# EAGLE design hover_controller_v3 (EAGLE 8.2.1)
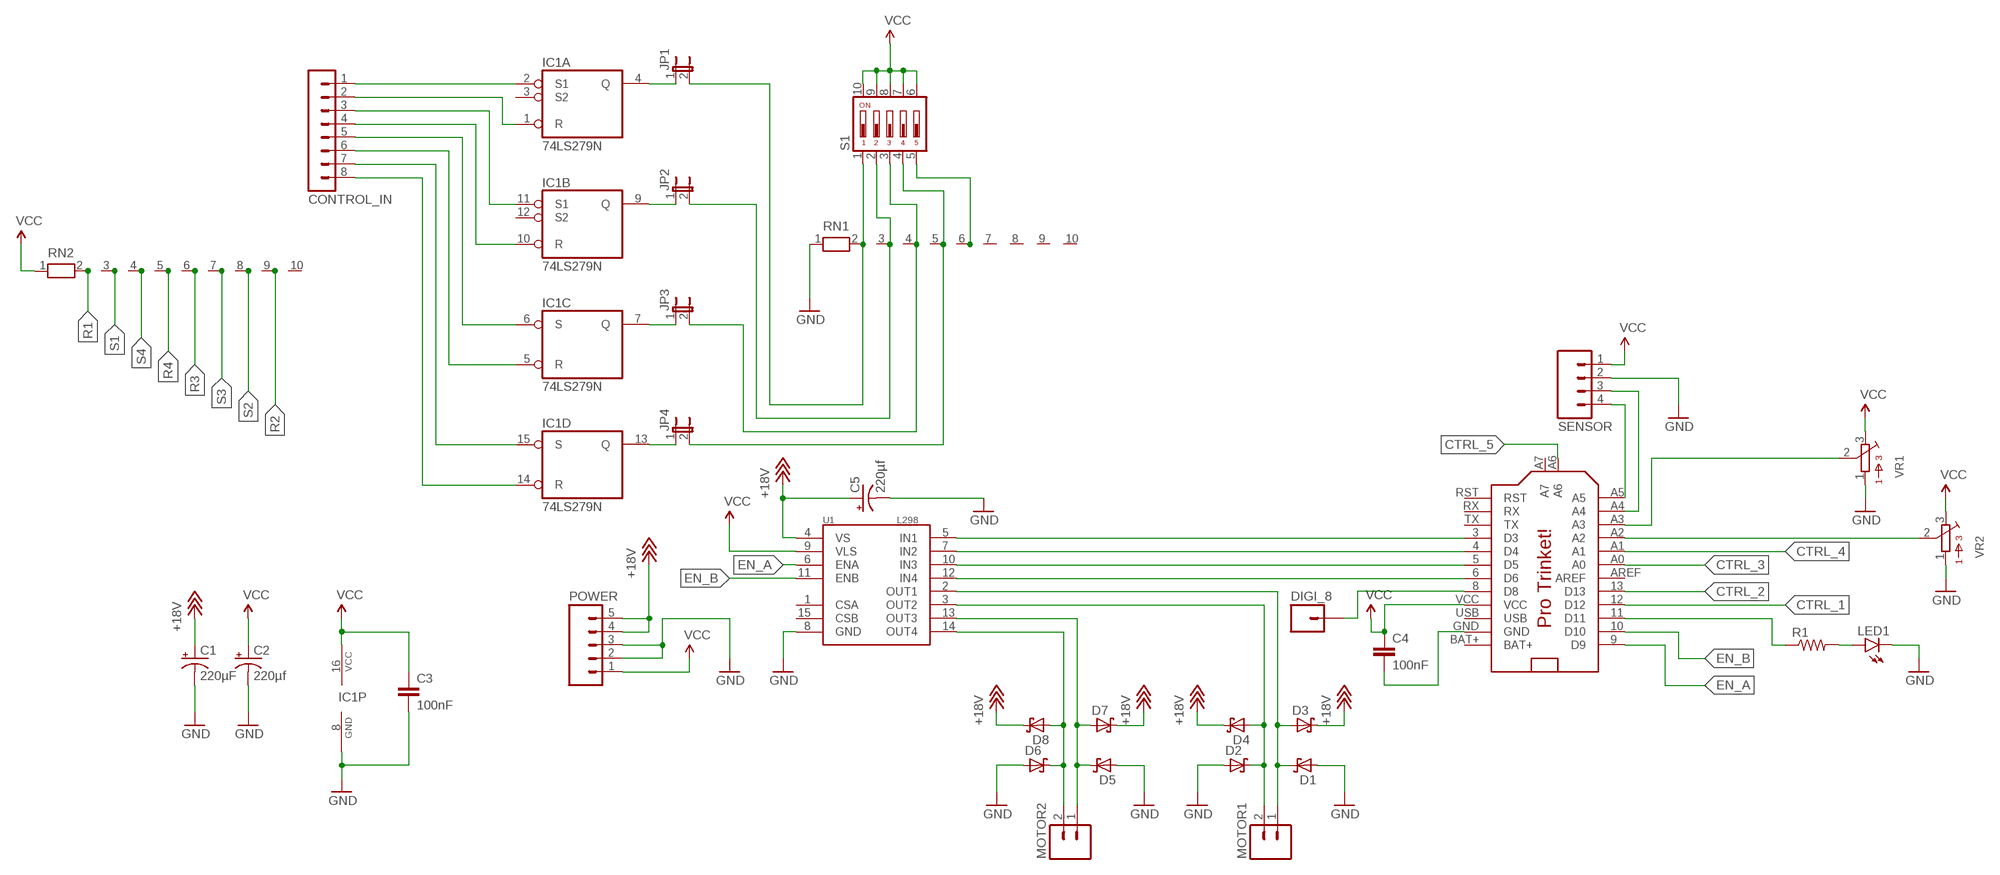
[diagram p0: schematic, sheet 1]

## Parts
C1  220µF  CAP_POLPTH2  [CPOL-RADIAL-10UF-25V]
C2  220µf  CAP_POLPTH2  [CPOL-RADIAL-10UF-25V]
C3  100nF  CAPPTH1  [CAP-PTH-5MM]
C4  100nF  CAPPTH1  [CAP-PTH-5MM]
C5  220µf  CAP_POLPTH2  [CPOL-RADIAL-10UF-25V]
CONTROL_IN  MA08-1  [MA08-1]
D1  SCHOTTKY-DIODEDO35-7  [DO35-7]
D2  SCHOTTKY-DIODEDO35-7  [DO35-7]
D3  SCHOTTKY-DIODEDO35-7  [DO35-7]
D4  SCHOTTKY-DIODEDO35-7  [DO35-7]
D5  SCHOTTKY-DIODEDO35-7  [DO35-7]
D6  SCHOTTKY-DIODEDO35-7  [DO35-7]
D7  SCHOTTKY-DIODEDO35-7  [DO35-7]
D8  SCHOTTKY-DIODEDO35-7  [DO35-7]
DIGI_8  M01PTH  [1X01]
IC1  74LS279N  [DIL16]
JP1  JUMPER-2PTH  [1X02]
JP2  JUMPER-2PTH  [1X02]
JP3  JUMPER-2PTH  [1X02]
JP4  JUMPER-2PTH  [1X02]
LED1  LED-3MM-NO_SILK  [LED3MM-NS]
MOTOR1  M02PTH  [1X02]
MOTOR2  M02PTH  [1X02]
POWER  M05JST-VERT  [JST-5-PTH-VERT]
R1  RESISTORPTH-1/4W  [AXIAL-0.4]
RN1  RN09  [RN-10]
RN2  RN09  [RN-10]
S1  DIP05YL  [DIP05YL]
SENSOR  M04PTH  [1X04]
U1  L298  [MULTIWATT15]
U$1  PRO_TRINKET  [PROTRINKET]
VR1  BOURNS_3362P_TRIMMERP  [BOURNS_3362P_TRIMMER]
VR2  BOURNS_3362P_TRIMMERP  [BOURNS_3362P_TRIMMER]

## Nets
+18V: C1.1(+) C5.1(+) D3.C D4.C D7.C D8.C POWER.4 POWER.5 U1.4(VS)
CTRL_1: JP1.2 RN1.2 S1.1 U$1.12(D12)
CTRL_2: JP2.2 RN1.3 S1.2 U$1.13(D13)
CTRL_3: JP3.2 RN1.4 S1.3 U$1.A0
CTRL_4: JP4.2 RN1.5 S1.4 U$1.A1
CTRL_5: RN1.6 S1.5 U$1.A6
EN_A: U1.6(ENA) U$1.9(D9)
EN_B: U1.11(ENB) U$1.10(D10)
GND: C1.2(-) C2.2(-) C3.2 C5.2(-) D1.A D2.A D5.A D6.A IC1.8(P:GND) LED1.K(C) POWER.2 POWER.3 RN1.1 SENSOR.2 U1.8(GND) VR1.1 VR2.1
N$1: IC1.4(A:Q) JP1.1
N$2: IC1.9(B:Q) JP2.1
N$3: IC1.7(C:Q) JP3.1
N$4: IC1.13(D:Q) JP4.1
N$5: U$1.A2 VR2.2
N$13: LED1.A R1.P$2
N$14: R1.P$1 U$1.11(D11)
N$15: DIGI_8.1 U$1.8(D8)
N$18: U$1.A3 VR1.2
N$20: SENSOR.4 U$1.A5
N$21: SENSOR.3 U$1.A4
N$22: U1.5(IN1) U$1.3(D3)
N$23: U1.7(IN2) U$1.4(D4)
N$24: U1.10(IN3) U$1.5(D5)
N$25: U1.12(IN4) U$1.6(D6)
N$26: D1.C D3.A MOTOR1.1 U1.2(OUT1)
N$27: D2.C D4.A MOTOR1.2 U1.3(OUT2)
N$28: D5.C D7.A MOTOR2.1 U1.13(OUT3)
N$29: D6.C D8.A MOTOR2.2 U1.14(OUT4)
N$30: C4.2 U$1.GND
R1: CONTROL_IN.2 IC1.1(A:R) RN2.2
R2: CONTROL_IN.4 IC1.10(B:R) RN2.9
R3: CONTROL_IN.6 IC1.5(C:R) RN2.6
R4: CONTROL_IN.8 IC1.14(D:R) RN2.5
S1: CONTROL_IN.1 IC1.2(A:S1) RN2.3
S2: CONTROL_IN.3 IC1.11(B:S1) RN2.8
S3: CONTROL_IN.5 IC1.6(C:S) RN2.7
S4: CONTROL_IN.7 IC1.15(D:S) RN2.4
VCC: C2.1(+) C3.1 C4.1 IC1.16(P:VCC) POWER.1 RN2.1 S1.6 S1.7 S1.8 S1.9 S1.10 SENSOR.1 U1.9(VLS) U$1.VCC VR1.3 VR2.3
Unconnected: IC1.3(A:S2) IC1.12(B:S2) RN1.7 RN1.8 RN1.9 RN1.10 RN2.10 U1.1(CSA) U1.15(CSB) U$1.A7 U$1.AREF U$1.RST U$1.RX U$1.TX

## Power pins joined to a net without a drawn wire
BAT+: U$1.BAT+
USB: U$1.USB

## Library data of the parts
C1 C2 C5 = SparkFun-Capacitors:CAP_POL: Capacitor Polarized These are standard SMD and PTH capacitors. Normally 10uF, 47uF, and 100uF in electrolytic and tantalum varieties. Always verify the external diameter of the through hole cap, it varies with capacity, voltage, and manufacturer. The EIA devices should be standard.
C3 C4 = SparkFun-Capacitors:CAP: Capacitor Standard 0603 ceramic capacitor, and 0.1" leaded capacitor.
CONTROL_IN = con-lstb:MA08-1: PIN HEADER; OC_FARNELL: unknown; OC_NEWARK: unknown
D1-D8 = adafruit:SCHOTTKY-DIODE: Schottky Diode
DIGI_8 = SparkFun-Connectors:M01: Header 1 Standard 1-pin 0.1" header. Use with straight break away headers (SKU : PRT-00116), right angle break away headers (PRT-00553), swiss pins (PRT-00743), machine pins (PRT-00117), and female headers (PRT-00115).
IC1 = 74xx-us:74*279: Quadruple S-R LATCH
JP1-JP4 = SparkFun-Retired:JUMPER-2: Jumper Basic 0.1" spaced jumper. Use with breakaway headers.
LED1 = SparkFun-LED:LED: LEDs Standard schematic elements and footprints for 5mm, 3mm, 1206, and 0603 sized LEDs. 5mm - Spark Fun Electronics SKU : COM-00529 (and others)
MOTOR1 MOTOR2 = SparkFun-Connectors:M02: Standard 2-pin 0.1" header. Use with - straight break away headers ( PRT-00116) - right angle break away headers (PRT-00553) - swiss pins (PRT-00743) - machine pins (PRT-00117) - female headers (PRT-00115) Molex polarized connector foot print use with: PRT-08233 with associated crimp pins and housings. 2.54_SCREWTERM for use with PRT-10571. 3.5mm Screw Terminal footprints for PRT-08084 5mm Screw Terminal footprints for use with PRT-08432
POWER = SparkFun-Connectors:M05: Header 5 Standard 5-pin 0.1" header. Use with straight break away headers (SKU : PRT-00116), right angle break away headers (PRT-00553), swiss pins (PRT-00743), machine pins (PRT-00117), and female headers (PRT-00115). Molex polarized connector foot print use with SKU : PRT-08230 with associated crimp pins and housings.
R1 = SparkFun-Resistors:RESISTOR: Resistor Basic schematic elements and footprints for 0603, 1206, and PTH resistors.
RN1 RN2 = resistor-net:RN09: RESISTOR NETWORK; OC_FARNELL: unknown; OC_NEWARK: unknown
S1 = switch-dil:DIP05YL: DIL/CODE SWITCH; OC_FARNELL: unknown; OC_NEWARK: unknown
SENSOR = SparkFun-Connectors:M04: Header 4 Standard 4-pin 0.1" header. Use with straight break away headers (SKU : PRT-00116), right angle break away headers (PRT-00553), swiss pins (PRT-00743), machine pins (PRT-00117), and female headers (PRT-00115). Molex polarized connector foot print use with SKU : PRT-08231 with associated crimp pins and housings. 1MM SMD Version SKU: PRT-10208
U1 = SparkFun-PowerIC:L298: L298 Dual Full Bridge Driver
U$1 = adafruit:PRO_TRINKET
VR1 VR2 = MusicThingModular:BOURNS_3362P_TRIMMER: 3362 Series 1/4" Square Trimmer

## Board
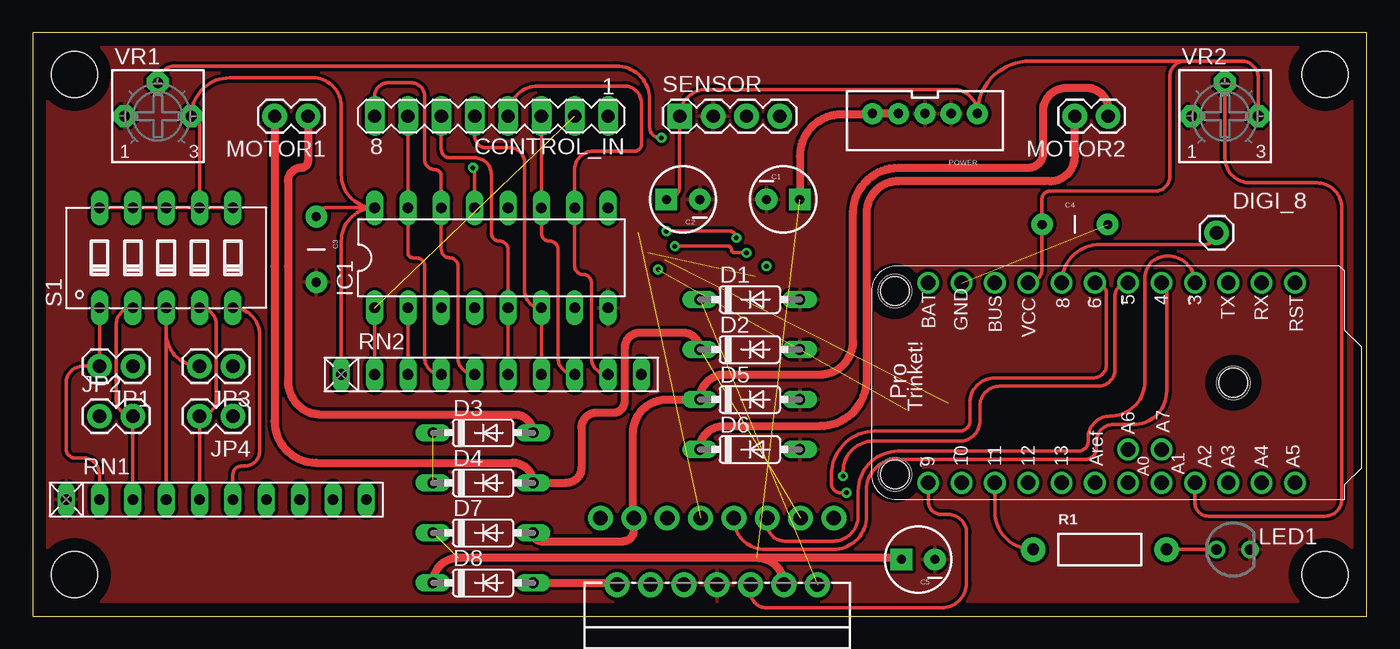
[diagram p1: board, top side]
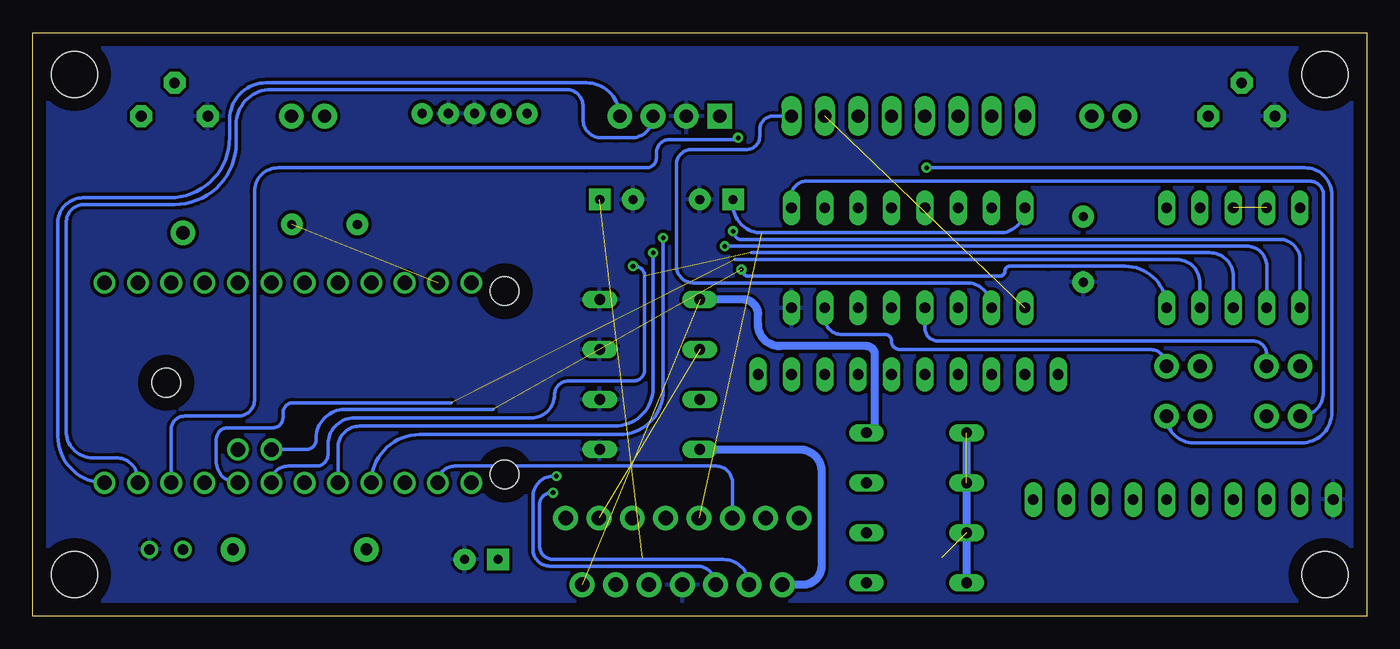
[diagram p2: board, bottom side, seen from below]

Size 101.6 x 44.45 mm. Coordinates in mm from the lower left corner, seen from the top.
Outline: 0,0 101.6,0 101.6,44.45 0,44.45 0,0
Copper layers (1*16): Top 0.035mm / dielectric 1.5mm / Bottom 0.035mm
Design rules "default": minimum track width 6mil, minimum drill 0.35mm, track to track 6mil, track to pad 6mil, pad to pad 6mil, via to via 6mil, smd to smd 6mil, copper to edge 40mil, drill to drill 6mil, minimum pad ring 10mil, minimum via ring 8mil, stop-mask expansion 4mil, vias tented up to drill 0mil, thermal gap 10mil
Holes 3.5 mm at 3.17,41.27 3.17,3.17 98.42,3.17 98.42,41.27

### Footprints (pad centres in the part's own frame; a part is rotated, then mirrored left to right if it is on the bottom)
CPOL-RADIAL-10UF-25V = drill 0.7 pad 1.651 square: 1 1.27,0 | drill 0.7 pad 1.651: 2 -1.27,0
CAP-PTH-5MM = drill 0.7 pad 1.651: 1 -2.5,0; 2 2.5,0
MA08-1 = drill 1.016 long: 1 -8.89,0; 2 -6.35,0; 3 -3.81,0; 4 -1.27,0; 5 1.27,0; 6 3.81,0; 7 6.35,0; 8 8.89,0
DO35-7 = drill 0.813 long: A 3.81,0; C -3.81,0
1X01 = drill 1.016 pad 1.88: 1 0,0
DIL16 = drill 0.813 long: 1 -8.89,-3.81; 2 -6.35,-3.81; 3 -3.81,-3.81; 4 -1.27,-3.81; 5 1.27,-3.81; 6 3.81,-3.81; 7 6.35,-3.81; 8 8.89,-3.81; 9 8.89,3.81; 10 6.35,3.81; 11 3.81,3.81; 12 1.27,3.81; 13 -1.27,3.81; 14 -3.81,3.81; 15 -6.35,3.81; 16 -8.89,3.81
1X02 = drill 1.016 pad 1.88: 1 0,0; 2 2.54,0
LED3MM-NS = drill 0.813: A -1.27,0; K 1.27,0
JST-5-PTH-VERT = drill 0.7 pad 1.6: 1 -4,0.18; 2 -2,0.18; 3 0,0.18; 4 2,0.18; 5 4,0.18
AXIAL-0.4 = drill 0.9 pad 1.88: P$1 -5.08,0; P$2 5.08,0
RN-10 = drill 0.813 long: 1 -11.43,0; 2 -8.89,0; 3 -6.35,0; 4 -3.81,0; 5 -1.27,0; 6 1.27,0; 7 3.81,0; 8 6.35,0; 9 8.89,0; 10 11.43,0
DIP05YL = drill 0.813 long: 1 -5.08,-3.81; 2 -2.54,-3.81; 3 0,-3.81; 4 2.54,-3.81; 5 5.08,-3.81; 6 5.08,3.81; 7 2.54,3.81; 8 0,3.81; 9 -2.54,3.81; 10 -5.08,3.81
1X04 = drill 1.016 pad 1.88 square: 1 0,0 | drill 1.016 pad 1.88: 2 2.54,0; 3 5.08,0; 4 7.62,0
MULTIWATT15 = drill 1.1 pad 1.9: 1 -8.95,-2.39; 2 -7.68,2.69; 3 -6.41,-2.39; 4 -5.14,2.69; 5 -3.87,-2.39; 6 -2.6,2.69; 7 -1.33,-2.39; 8 -0.06,2.69; 9 1.21,-2.39; 10 2.48,2.69; 11 3.75,-2.39; 12 5.02,2.69; 13 6.29,-2.39; 14 7.56,2.69; 15 8.83,-2.39
PROTRINKET = drill 1.1: 3 7.62,2.921; 4 7.62,5.461; 5 7.62,8.001; 6 7.62,10.541; 8 7.62,13.081; 9 -7.62,23.241; 10 -7.62,20.701; 11 -7.62,18.161; 12 -7.62,15.621; 13 -7.62,13.081; A0 -7.62,8.001; A1 -7.62,5.461; A2 -7.62,2.921; A3 -7.62,0.381; A4 -7.62,-2.159; A5 -7.62,-4.699; A6 -5.08,8.001; A7 -5.08,5.461; AREF -7.62,10.541; BAT+ 7.62,23.241; GND 7.62,20.701; RST 7.62,-4.699; RX 7.62,-2.159; TX 7.62,0.381; USB 7.62,18.161; VCC 7.62,15.621 | hole 2.2: -6.985,25.781; 6.985,25.781; 0,0
BOURNS_3362P_TRIMMER = drill 0.813 pad 1.676 octagon: 1 -2.54,0; 2 0,2.54; 3 2.54,0

### Placement (x,y rotation side)
C1  57.15,31.75 0 top
C2  49.53,31.75 180 top
C3  21.59,27.94 270 top
C4  79.38,29.84 0 top
C5  67.44,4.32 180 top
CONTROL_IN  34.92,38.1 180 top
D1  54.61,24.13 0 top
D2  54.61,20.32 0 top
D3  34.29,13.97 0 top
D4  34.29,10.16 0 top
D5  54.61,16.51 0 top
D6  54.61,12.7 0 top
D7  34.29,6.35 0 top
D8  34.29,2.54 0 top
DIGI_8  90.17,29.21 0 top
IC1  34.92,27.3 0 top
JP1  7.62,19.05 180 top
JP2  5.08,15.24 0 top
JP3  15.24,19.05 180 top
JP4  15.24,15.24 180 top
LED1  91.44,5.08 0 top
MOTOR1  20.95,38.1 180 top
MOTOR2  81.92,38.1 180 top
POWER  67.94,38.48 180 top
R1  81.28,5.08 0 top
RN1  13.97,8.89 0 top
RN2  34.92,18.41 0 top
S1  10.16,27.3 0 top
SENSOR  49.28,38.1 0 top
U1  52.07,5.08 180 top
U$1  91.44,17.78 90 top
VR1  9.53,38.1 0 top
VR2  90.81,38.1 0 top

### Tracks (layer width: path | path; a pad name or v marks a point on that pad's centre or on a via)
+18V  (3 unrouted)
  Top 0.61: D8.C arc-90 32.38,4.45 55.16,4.45 | 55.16,4.45 arc-90 U1.4 | C5.1 arc90 66.04,4.45 55.16,4.45 | POWER.4 POWER.5 arc-90 63.87,38.23 61.59,38.23 arc90 58.42,35.05 C1.1
  Bottom 0.61: D3.C D8.C
CTRL_1  (via drill 0.35)
  Top 0.254: S1.1 JP1.2 3.81,19.05 arc90 2.54,17.78 2.54,12.7 arc90 3.17,12.06 3.81,12.06 arc-90 5.08,10.79 RN1.2 | v48.26,29.34 53.09,29.34 arc-90 v53.59,28.83
  Bottom 0.254: S1.1 5.08,27.18 arc-90 6.6,28.7 47.62,28.7 arc90 v48.26,29.34 | U$1.12 arc90 72.14,13.84 56.9,13.84 arc-90 53.59,17.14 v53.59,28.83
CTRL_2  (via drill 0.35)
  Top 0.254: S1.2 arc90 6.35,22.23 6.35,16.51 arc90 JP2.2 RN1.3 | v54.36,27.69 53.47,27.69 arc-90 53.21,27.94 arc90 52.96,28.19 v48.9,28.19
  Bottom 0.254: S1.2 7.62,26.67 arc-90 9.14,28.19 v48.9,28.19 | U$1.13 78.36,12.83 arc90 76.71,14.48 70.74,14.48 63.5,14.48 59.05,14.48 57.28,14.48 arc-90 54.36,17.4 54.36,25.4 v54.36,27.69 | v54.36,27.69 54.36,27.81 v54.36,27.69
CTRL_3  (via drill 0.35)  (1 unrouted)
  Top 0.254: S1.3 10.16,22.86 10.16,21.59 | 10.16,21.59 arc90 JP3.2 | RN1.4 10.16,21.59
  Bottom 0.254: S1.3 10.16,25.91 arc-90 11.94,27.69 46.86,27.69 | U$1.A0 arc90 82.17,11.43 80.01,11.43 arc-90 79.12,12.32 79.12,13.08 arc90 77.09,15.11 63.63,15.11 arc-90 61.85,16.89 arc90 60.83,17.91 55.88,17.91 arc-90 54.99,18.8 54.99,25.4 54.99,25.91 arc-99 v55.88,26.67
CTRL_4  (1 unrouted)
  Top 0.254: S1.4 arc-90 13.97,22.23 13.97,16.51 arc-90 JP4.2 RN1.5
  Bottom 0.254: S1.4 12.7,25.4 arc-90 14.48,27.18 48.13,27.18 | U$1.A1 arc90 87.63,11.81 87.63,13.46 arc90 86.74,14.35 83.31,14.35 arc-90 82.55,15.11 82.55,15.49 arc90 81.79,16.26 69.72,16.26
CTRL_5  (via drill 0.35)  (1 unrouted)
  Top 0.254: RN1.6 15.24,10.79 arc-90 15.88,11.43 16.13,11.43 arc90 17.27,12.57 17.27,21.46 arc90 S1.5
  Bottom 0.254: 15.24,23.88 S1.5 arc-90 18.41,26.67 24.26,26.67 27.18,26.67 arc-90 27.56,26.29 arc90 27.94,25.91 38.1,25.91 45.97,25.91 47.12,25.91 arc90 47.5,26.29 arc-90 v47.62,26.42 | U$1.A6 80.77,12.7 arc-90 80.01,13.46 80.01,13.59 arc90 77.85,15.75 66.55,15.75
EN_A
  Top 0.254: U1.6 54.67,1.84 arc90 55.88,0.64 62.87,0.64 69.22,0.64 arc90 71.12,2.54 71.12,6.35 arc90 69.72,7.75 69.22,7.75 arc-90 68.2,8.76 U$1.9
EN_B
  Bottom 0.254: U$1.10 arc90 69.47,11.43 49.53,11.43 arc90 48.32,10.22 U1.11
GND
  pour Top (isolate 0.254): 0,0 101.6,0 101.6,44.45 0,44.45
  pour Bottom (isolate 0.254): 0,0 101.6,0 101.6,44.45 0,44.45
N$1
  Bottom 0.254: IC1.4 33.66,21.97 arc-90 32.64,20.95 8.64,20.95 arc90 7.62,19.94 JP1.1
N$2
  Bottom 0.254: JP2.1 arc-90 3.3,17.02 3.3,32.13 arc-90 4.32,33.15 42.67,33.15 arc-90 43.81,32 IC1.9
N$3
  Bottom 0.254: JP3.1 arc-90 16.51,20.32 35.56,20.32 arc90 36.2,20.95 arc-90 36.7,21.46 40.01,21.46 arc90 41.27,22.73 IC1.7
N$4  (via drill 0.35)
  Top 0.254: v33.53,34.16 arc-90 33.66,34.04 IC1.13
  Bottom 0.254: JP4.1 arc-90 13.21,13.21 4.95,13.21 arc-90 2.67,15.49 2.67,32.13 arc-90 4.7,34.16 v33.53,34.16 33.53,34.29
N$5
  Top 0.254: U$1.A2 88.52,8.64 arc90 89.53,7.62 98.42,7.62 arc90 99.69,8.89 99.69,31.11 arc90 97.79,33.02 92.71,33.02 arc-90 90.81,34.92 VR2.2
N$13
  Top 0.254: R1.P$2 LED1.A
N$14
  Top 0.254: R1.P$1 arc-90 73.28,8 U$1.11
N$15
  Top 0.254: U$1.8 arc-90 81.28,28.32 89.28,28.32 arc90 DIGI_8.1
N$18  (via drill 0.35)
  Top 0.254: VR1.2 arc-90 10.79,41.91 44.45,41.91 arc-90 46.99,39.37 46.99,37.72 46.99,37.21 arc90 47.75,36.45 v47.88,36.45
  Bottom 0.254: v47.88,36.45 arc90 48.01,36.32 50.42,36.32 53.09,36.32 arc-90 54.1,35.31 54.1,34.92 arc90 54.86,34.16 59.44,34.16 81.03,34.16 82.93,34.16 arc-90 84.71,32.38 84.71,16.51 arc90 85.98,15.24 90.04,15.24 arc-90 91.06,14.22 U$1.A3
N$20
  Bottom 0.254: SENSOR.4 arc-90 59.44,40.64 71.12,40.64 82.55,40.64 83.82,40.64 arc-90 86.61,37.85 86.61,36.45 arc90 91.19,31.88 97.79,31.88 arc-90 99.69,29.97 99.69,13.72 arc-90 U$1.A5
N$21
  Bottom 0.254: SENSOR.3 arc90 56.01,36.45 57.15,36.45 58.29,36.45 arc90 59.69,37.85 59.69,38.86 arc-90 60.96,40.13 62.61,40.13 76.96,40.13 83.44,40.13 arc-90 86.11,37.47 86.11,36.07 arc90 90.81,31.37 97.66,31.37 arc-90 99.06,29.97 99.06,14.1 arc-90 97.03,12.06 95.25,12.06 arc90 93.6,10.41 U$1.A4
N$22
  Top 0.254: U$1.3 arc90 86.49,27.43 86.36,27.43 arc90 84.71,25.78 84.71,17.91 arc-90 82.04,15.24 arc90 80.39,13.59 80.39,13.34 arc-90 79.63,12.57 65.91,12.57 arc90 62.87,9.53 62.87,7.62 arc-90 60.96,5.71 57.28,5.71 arc-90 55.94,7.05 U1.5
N$23
  Top 0.254: U$1.4 arc-90 86.36,25.02 86.36,17.14 arc-90 83.82,14.61 82.3,14.61 arc90 81.03,13.34 81.03,12.83 arc-90 80.14,11.94 65.79,11.94 arc90 63.5,9.65 63.5,7.62 arc-90 60.96,5.08 55.79,5.08 arc-90 U1.7
N$24  (via drill 0.35)
  Top 0.254: U$1.5 arc90 82.42,24.38 82.42,18.8 arc-90 81.15,17.53 73.66,17.53 arc90 72.14,16 72.14,14.86 arc-90 70.61,13.34 64.01,13.34 arc90 61.72,11.05 v61.72,10.67
  Bottom 0.254: U1.10 arc-90 51.01,3.81 62.23,3.81 arc90 63.5,5.08 63.5,8.89 arc104 v61.72,10.67
N$25  (via drill 0.35)
  Top 0.254: U$1.6 arc-90 81.79,24.51 81.79,19.18 arc-90 80.77,18.16 73.28,18.16 arc90 71.37,16.26 71.37,14.86 arc-90 70.61,14.1 64.14,14.1 arc90 60.83,10.79 60.83,10.16 arc90 61.47,9.4 v61.98,9.4
  Bottom 0.254: U1.12 arc-90 48.98,4.32 61.98,4.32 arc90 62.99,5.33 62.99,8.64 arc90 v61.98,9.4
N$26  (1 unrouted)
  Top 0.61: MOTOR1.1 20.95,34.67 arc-90 20.45,34.16 arc90 19.43,33.15 19.43,26.67 19.43,17.91 arc90 21.97,15.37 36.7,15.37 arc-90 D3.A
  Bottom 0.61: D3.A arc-90 37.47,14.61 37.47,19.94 arc-90 38.1,20.57 44.7,20.57 arc90 46.35,22.23 46.35,22.99 arc-90 47.5,24.13 D1.C
N$27  (1 unrouted)
  Top 0.61: D2.C arc90 49.53,21.59 46.23,21.59 arc90 45.09,20.45 45.09,16.38 arc-90 44.2,15.49 42.93,15.49 arc90 41.78,14.35 41.78,11.3 arc-90 40.64,10.16 D4.A arc90 36.58,11.68 21.59,11.68 arc-90 18.41,14.86 18.41,26.67 MOTOR1.2
N$28
  Top 0.61: D7.A arc90 38.73,5.71 44.96,5.71 arc90 45.78,6.54 U1.13 arc-90 45.72,7.53 45.72,13.97 arc-90 48.26,16.51 D5.C arc-90 52.7,18.41 59.94,18.41 arc90 62.48,20.95 62.48,30.73 arc-90 65.91,34.16 75.82,34.16 arc90 76.96,35.31 76.96,38.48 arc-90 78.74,40.26 80.26,40.26 arc-90 81.92,38.61 MOTOR2.1
N$29
  Top 0.61: D8.A 44.36,2.54 arc-90 U1.14 | D6.C arc-90 52.58,14.48 59.94,14.48 arc90 63.5,18.03 63.5,30.73 arc-90 65.91,33.15 77.47,33.15 arc90 79.38,35.05 MOTOR2.2
  Bottom 0.61: D6.C 43.18,12.7 arc90 41.53,11.05 41.53,3.81 arc90 42.95,2.39 U1.14
N$30  (1 unrouted)
R1  (1 unrouted)
  Top 0.254: RN2.2 IC1.1
R2
  Top 0.254: RN2.9 arc-90 42.55,19.68 42.55,25.4 arc90 41.91,26.04 arc-90 41.27,26.67 IC1.10 41.27,34.04 arc-90 42.67,35.43 45.85,35.43 arc90 46.35,35.94 46.35,39.12 arc90 45.09,40.39 38.48,40.39 arc90 CONTROL_IN.4
R3
  Top 0.254: RN2.6 IC1.5 36.2,27.94 arc90 35.56,28.57 arc-90 34.92,29.21 34.92,33.66 arc90 33.66,34.92 33.02,34.92 31.75,34.92 arc-90 31.11,35.56 CONTROL_IN.6
R4
  Top 0.254: RN2.5 arc-90 32.38,19.68 32.38,26.67 arc90 31.75,27.3 arc-90 31.11,27.94 IC1.14 31.11,33.53 arc90 30.61,34.04 arc-90 29.84,34.8 29.84,39.62 arc90 28.83,40.64 27.05,40.64 arc90 26.04,39.62 CONTROL_IN.8
S1
  Top 0.254: RN2.3 IC1.2
  Bottom 0.254: IC1.2 arc-90 30.48,25.4 51.31,25.4 arc90 52.58,26.67 52.58,34.42 arc90 51.44,35.56 47.24,35.56 arc-90 46.23,36.58 46.23,37.08 arc90 45.21,38.1 CONTROL_IN.1
S2
  Top 0.254: RN2.8 arc-90 40.01,19.68 40.01,27.94 arc90 39.37,28.57 arc-90 38.73,29.21 IC1.11 CONTROL_IN.3
S3
  Top 0.254: RN2.7 IC1.6 arc-90 37.47,24.77 37.47,34.54 arc90 36.32,35.69 34.54,35.69 arc-90 33.66,36.58 CONTROL_IN.5
S4
  Top 0.254: CONTROL_IN.7 IC1.15 28.57,27.69 arc90 28.96,27.3 29.21,27.3 arc-90 29.84,26.67 29.84,19.68 arc90 RN2.4
VCC  (2 unrouted)
  Top 0.254: S1.7 S1.8 S1.10 | S1.7 S1.6 | IC1.16 22.27,31.11 arc90 C3.1 | RN2.1 23.5,28.57 arc-90 IC1.16 | S1.7 12.7,37.47 arc90 VR1.3 arc-90 14.99,41.02 21.34,41.02 arc-90 23.5,38.86 23.5,33.66 arc90 IC1.16 | VR2.3 93.34,41.02 arc90 92.08,42.29 90.17,42.29 | 90.17,42.29 87.76,42.29 arc90 86.61,41.15 86.61,33.53 arc-90 85.47,32.38 77.47,32.38 arc90 76.88,31.79 76.88,29.34 | U$1.VCC arc90 76.88,26.46 76.88,29.34 | 76.88,29.34 C4.1 | C2.1 arc90 49.28,32.77 SENSOR.1 arc-90 51.31,40.13 70.11,40.13 arc-90 POWER.1 arc-90 75.94,42.29 90.17,42.29
  Bottom 0.254: IC1.16 arc90 27.94,29.21 46.1,29.21 arc90 48.26,31.37 C2.1